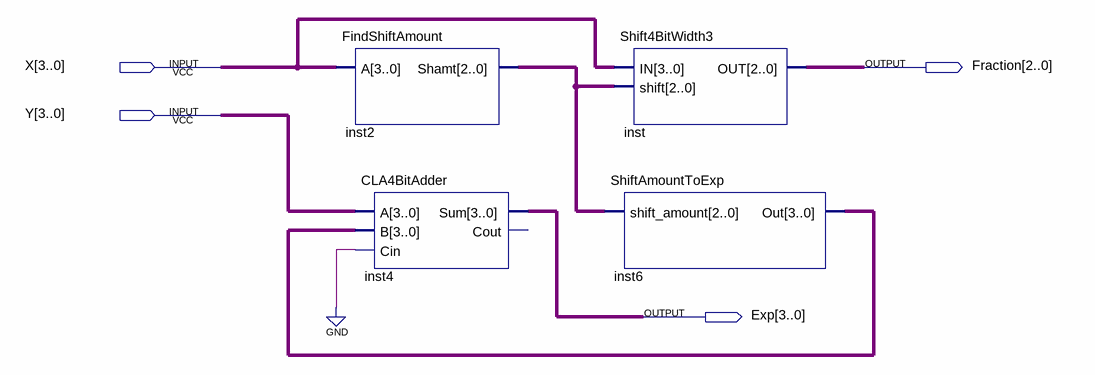
[diagram p0: schematic sheet]
// Quartus schematic FinalCircuit.bdf as structural Verilog: 4 symbols, 4 pins
module FinalCircuit (
  input  [3:0] X,
  input  [3:0] Y,
  output [2:0] Fraction,
  output [3:0] Exp
);

  wire [2:0] inst2_shamt;
  wire [3:0] inst6_out;

  FindShiftAmount inst2 (.A(X), .Shamt(inst2_shamt));
  CLA4BitAdder inst4 (.A(Y), .B(inst6_out), .Cin(1'b0), .Sum(Exp));  // open: Cout
  Shift4BitWidth3 inst (.IN(X), .shift(inst2_shamt), .OUT(Fraction));
  ShiftAmountToExp inst6 (.shift_amount(inst2_shamt), .Out(inst6_out));
endmodule
